# EAGLE schematic RAM (EAGLE 9.6.2)
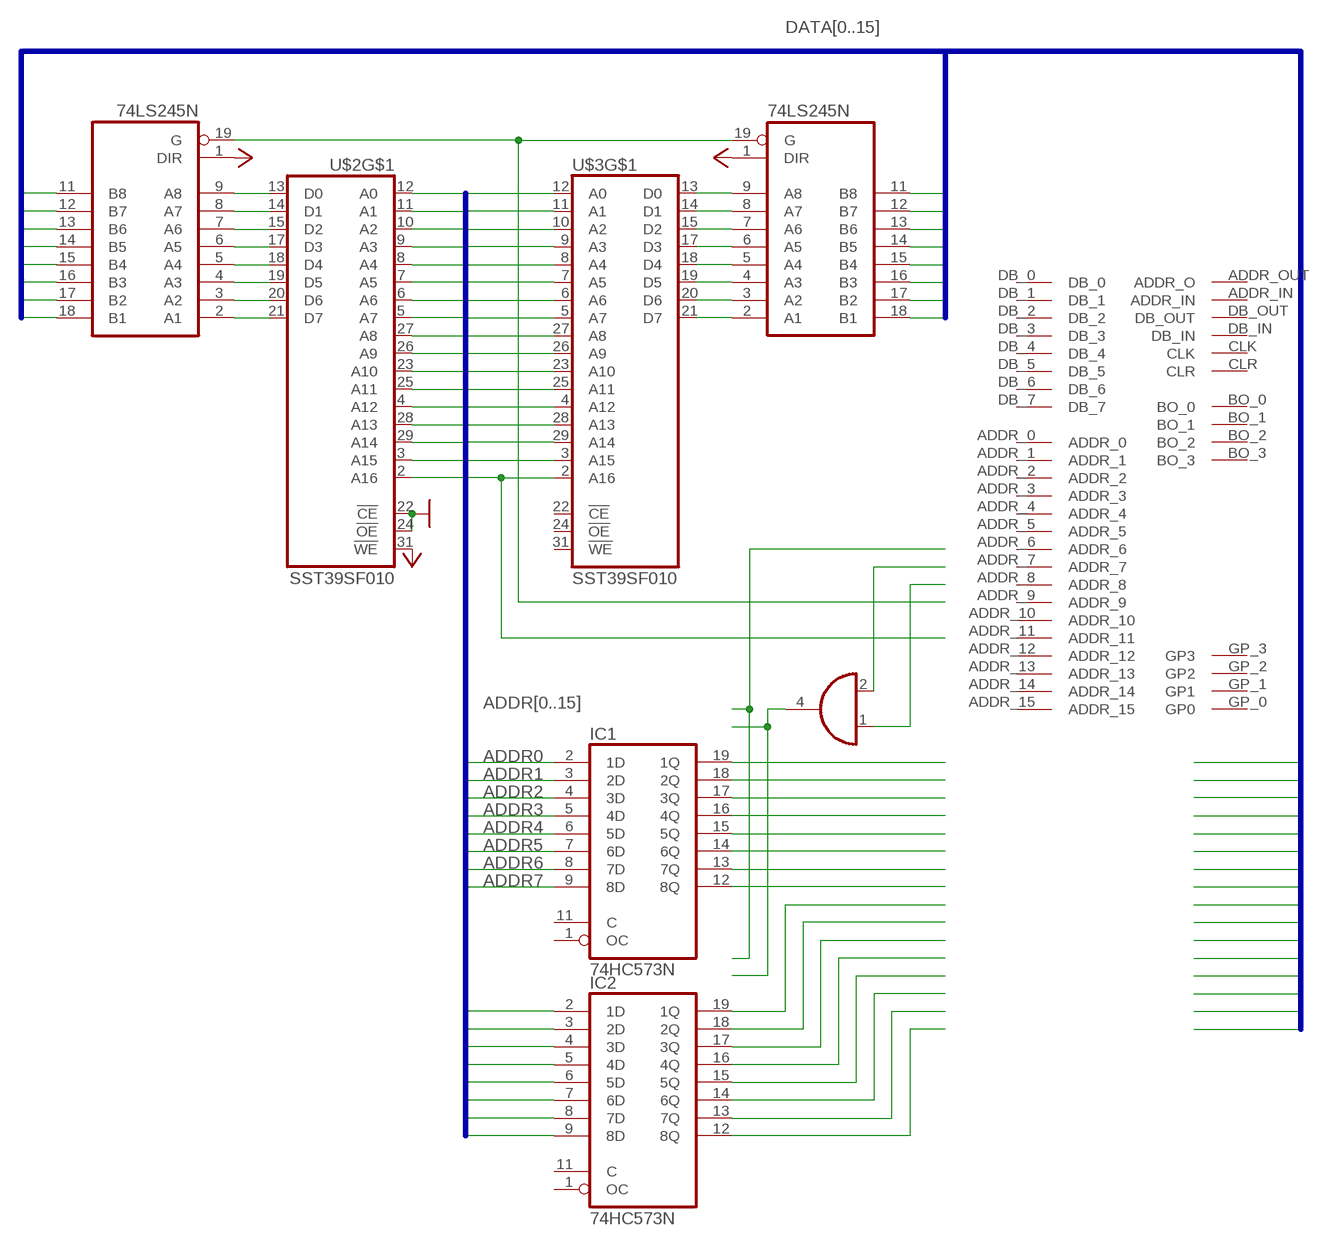
[diagram p0: schematic, sheet 1]

## Parts
IC1  74HC573N  [DIL20]
IC2  74HC573N  [DIL20]
IC4  74AHC1G08DCK  [SC70-5]
OUTPUT_BUFFER_MEMORY  74LS245N  [DIL20]
OUTPUT_BUFFER_MEMORY1  74LS245N  [DIL20]
U$1  BACKPLATE_INTERFACEEDGE_FINGER  [BACK_INTERFACE-FOOT]
U$2  SST39SF010  [DIP32-WIDE]
U$3  SST39SF010  [DIP32-WIDE]

## Nets
ADDR0: IC1.2(1D) U$2.12(A0) U$3.12(A0)
ADDR1: IC1.3(2D) U$2.11(A1) U$3.11(A1)
ADDR2: IC1.4(3D) U$2.10(A2) U$3.10(A2)
ADDR3: IC1.5(4D) U$2.9(A3) U$3.9(A3)
ADDR4: IC1.6(5D) U$2.8(A4) U$3.8(A4)
ADDR5: IC1.7(6D) U$2.7(A5) U$3.7(A5)
ADDR6: IC1.8(7D) U$2.6(A6) U$3.6(A6)
ADDR7: IC1.9(8D) U$2.5(A7) U$3.5(A7)
ADDR8: IC2.2(1D) U$2.27(A8) U$3.27(A8)
ADDR9: IC2.3(2D) U$2.26(A9) U$3.26(A9)
ADDR10: IC2.4(3D) U$2.23(A10) U$3.23(A10)
ADDR11: IC2.5(4D) U$2.25(A11) U$3.25(A11)
ADDR12: IC2.6(5D) U$2.4(A12) U$3.4(A12)
ADDR13: IC2.7(6D) U$2.28(A13) U$3.28(A13)
ADDR14: IC2.8(7D) U$2.3(A15) U$2.29(A14) U$3.29(A14)
ADDR15: IC2.9(8D) U$3.3(A15)
DATA0: OUTPUT_BUFFER_MEMORY.11(B8)
DATA1: OUTPUT_BUFFER_MEMORY.12(B7)
DATA2: OUTPUT_BUFFER_MEMORY.13(B6)
DATA3: OUTPUT_BUFFER_MEMORY.14(B5)
DATA4: OUTPUT_BUFFER_MEMORY.15(B4)
DATA5: OUTPUT_BUFFER_MEMORY.16(B3)
DATA6: OUTPUT_BUFFER_MEMORY.17(B2)
DATA7: OUTPUT_BUFFER_MEMORY.18(B1)
DATA8: OUTPUT_BUFFER_MEMORY1.11(B8)
DATA9: OUTPUT_BUFFER_MEMORY1.12(B7)
DATA10: OUTPUT_BUFFER_MEMORY1.13(B6)
DATA11: OUTPUT_BUFFER_MEMORY1.14(B5)
DATA12: OUTPUT_BUFFER_MEMORY1.15(B4)
DATA13: OUTPUT_BUFFER_MEMORY1.16(B3)
DATA14: OUTPUT_BUFFER_MEMORY1.17(B2)
DATA15: OUTPUT_BUFFER_MEMORY1.18(B1)
GND: U$2.22(!CE) U$2.24(!OE)
N$1: IC1.19(1Q)
N$2: IC1.18(2Q)
N$3: IC1.17(3Q)
N$4: IC1.16(4Q)
N$5: IC1.15(5Q)
N$6: IC1.14(6Q)
N$7: IC1.13(7Q)
N$8: IC1.12(8Q)
N$9: IC2.19(1Q)
N$10: IC2.18(2Q)
N$11: IC2.17(3Q)
N$12: IC2.16(4Q)
N$13: IC2.15(5Q)
N$14: IC2.14(6Q)
N$15: IC2.13(7Q)
N$16: IC2.12(8Q)
N$17: U$2.2(A16) U$3.2(A16)
N$19: IC4.4(O)
N$20: OUTPUT_BUFFER_MEMORY1.19(G) OUTPUT_BUFFER_MEMORY.19(G)
N$21: IC4.1(I0)
N$22: IC4.2(I1)
N$23: OUTPUT_BUFFER_MEMORY.2(A1) U$2.21(D7)
N$24: OUTPUT_BUFFER_MEMORY.3(A2) U$2.20(D6)
N$25: OUTPUT_BUFFER_MEMORY.4(A3) U$2.19(D5)
N$26: OUTPUT_BUFFER_MEMORY.5(A4) U$2.18(D4)
N$27: OUTPUT_BUFFER_MEMORY.6(A5) U$2.17(D3)
N$28: OUTPUT_BUFFER_MEMORY.7(A6) U$2.15(D2)
N$29: OUTPUT_BUFFER_MEMORY.8(A7) U$2.14(D1)
N$30: OUTPUT_BUFFER_MEMORY.9(A8) U$2.13(D0)
N$31: OUTPUT_BUFFER_MEMORY1.2(A1) U$3.21(D7)
N$32: OUTPUT_BUFFER_MEMORY1.3(A2) U$3.20(D6)
N$33: OUTPUT_BUFFER_MEMORY1.4(A3) U$3.19(D5)
N$34: OUTPUT_BUFFER_MEMORY1.5(A4) U$3.18(D4)
N$35: OUTPUT_BUFFER_MEMORY1.6(A5) U$3.17(D3)
N$36: OUTPUT_BUFFER_MEMORY1.7(A6) U$3.15(D2)
N$37: OUTPUT_BUFFER_MEMORY1.8(A7) U$3.14(D1)
N$38: OUTPUT_BUFFER_MEMORY1.9(A8) U$3.13(D0)
VCC: OUTPUT_BUFFER_MEMORY1.1(DIR) OUTPUT_BUFFER_MEMORY.1(DIR) U$2.31(!WE)
Unconnected: IC1.1(OC) IC1.11(C) IC2.1(OC) IC2.11(C) U$1.ADDR_0 U$1.ADDR_1 U$1.ADDR_2 U$1.ADDR_3 U$1.ADDR_4 U$1.ADDR_5 U$1.ADDR_6 U$1.ADDR_7 U$1.ADDR_8 U$1.ADDR_9 U$1.ADDR_10 U$1.ADDR_11 U$1.ADDR_12 U$1.ADDR_13 U$1.ADDR_14 U$1.ADDR_15 U$1.ADDR_IN U$1.ADDR_OUT(ADDR_O) U$1.BO_0 U$1.BO_1 U$1.BO_2 U$1.BO_3 U$1.CLK U$1.CLR U$1.DB_0 U$1.DB_1 U$1.DB_2 U$1.DB_3 U$1.DB_4 U$1.DB_5 U$1.DB_6 U$1.DB_7 U$1.DB_IN U$1.DB_OUT U$1.GP_0(GP0) U$1.GP_1(GP1) U$1.GP_2(GP2) U$1.GP_3(GP3) U$1.NC_0 U$1.NC_1 U$1.NC_2 U$1.NC_3 U$1.NC_4 U$1.NC_5 U$1.NC_6 U$1.NC_7 U$1.NC_8 U$1.NC_9 U$1.NC_10 U$1.NC_11 U$1.NC_12 U$1.NC_13 U$1.NC_14 U$1.NC_15 U$1.NC_16 U$1.NC_17 U$1.NC_18 U$1.NC_19 U$1.NC_20 U$1.NC_21 U$3.22(!CE) U$3.24(!OE) U$3.31(!WE)

## Buses
ADDR[0..15]
DATA[0..15]

## Power pins joined to a net without a drawn wire
GND: IC1.10(GND) IC2.10(GND) IC4.3(GND) OUTPUT_BUFFER_MEMORY1.10(GND) OUTPUT_BUFFER_MEMORY.10(GND) U$1.GND_0(GND) U$1.GND_1(GND) U$2.16(GND) U$3.16(GND)
VCC: IC1.20(VCC) IC2.20(VCC) IC4.5(VCC) OUTPUT_BUFFER_MEMORY1.20(VCC) OUTPUT_BUFFER_MEMORY.20(VCC) U$1.VCC_0(VCC) U$1.VCC_1(VCC) U$2.32(VCC) U$3.32(VCC)

## Library data of the parts
IC1 IC2 = 74xx-eu:74*573: 8-bit D latch BUS DRIVER
IC4 = 74xx-little-de:74*1G08: 2-input AND gate
OUTPUT_BUFFER_MEMORY OUTPUT_BUFFER_MEMORY1 = 74xx-eu:74*245: Octal BUS TRANSCEIVER, 3-state
U$1 = Computer:BACKPLATE_INTERFACE
U$2 U$3 = Computer:SST39SF010